# Altium schematic sheet STM3205P_Controller.SchDoc
size A3; Organization: Canis Tech; Address1: -; Address2: -; Address3: -; Address4: Indaiatuba/SP; DocumentNumber: 4; SheetNumber: 4; SheetTotal: 9; Address5: Brazil
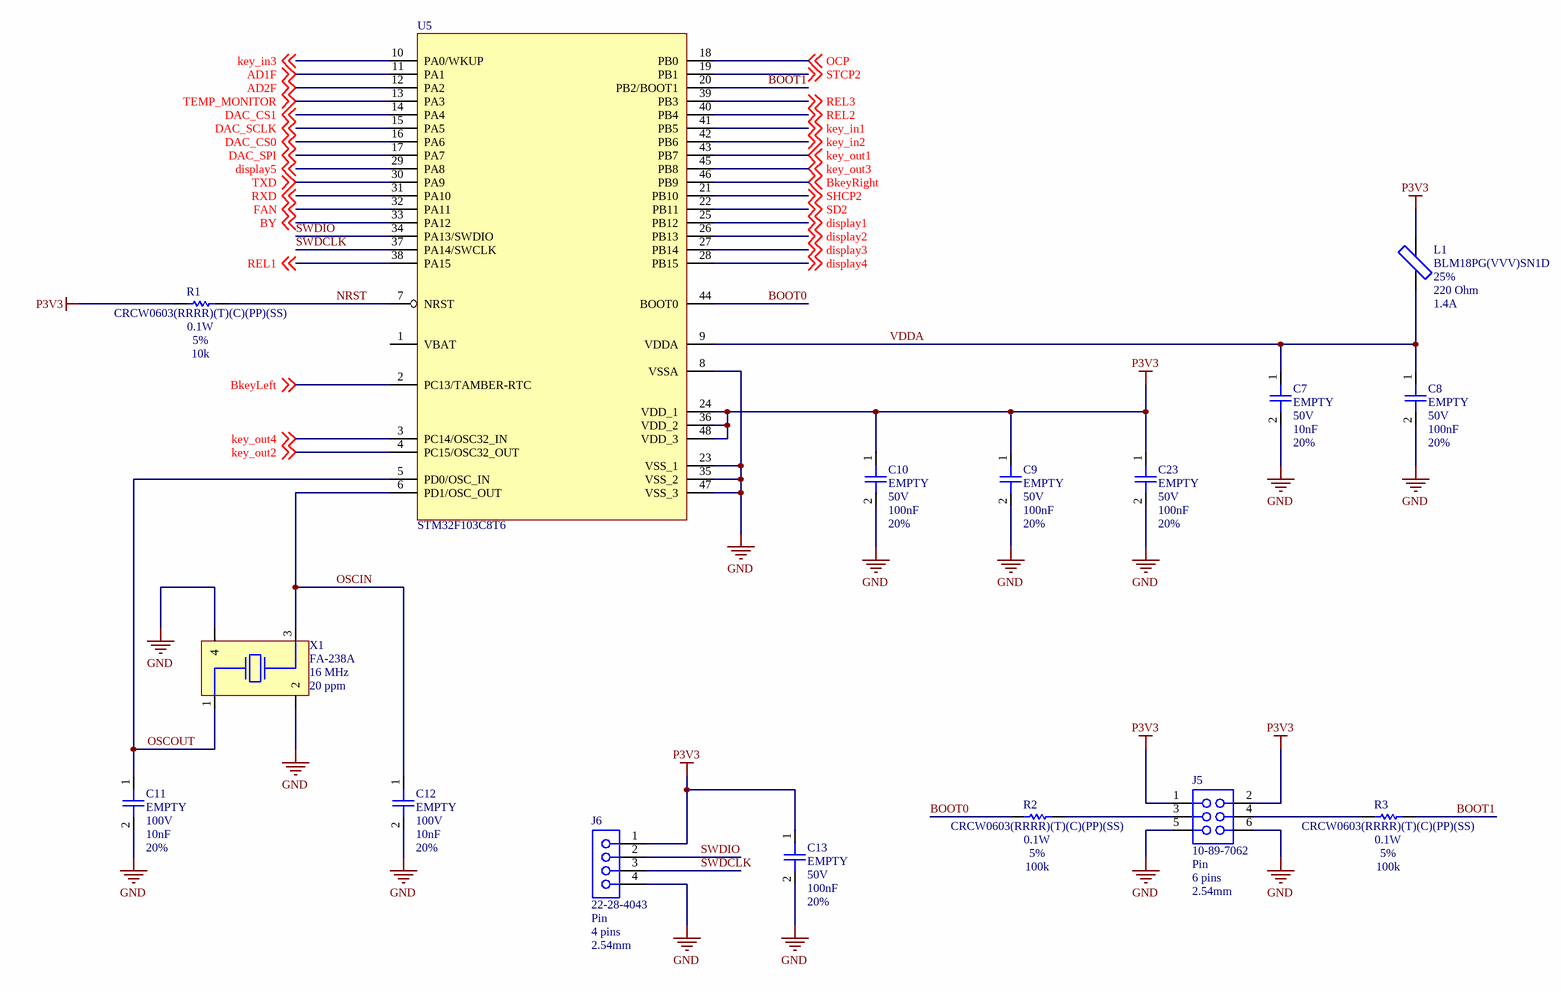
[diagram p0: STM3205P_Controller.SchDoc]

## Parts
C7  value 10nF  PartNumber1: EMPTY  Voltage: 50V  Tolerance: 20%  [CAP0603]  (hidden comment: CC0603)
C8  value 100nF  PartNumber1: EMPTY  Voltage: 50V  Tolerance: 20%  [CAP0603]  (hidden comment: CC0603)
C9  value 100nF  PartNumber1: EMPTY  Voltage: 50V  Tolerance: 20%  [CAP0603]  (hidden comment: CC0603)
C10  value 100nF  PartNumber1: EMPTY  Voltage: 50V  Tolerance: 20%  [CAP0603]  (hidden comment: CC0603)
C11  value 10nF  PartNumber1: EMPTY  Voltage: 100V  Tolerance: 20%  [CAP0603]  (hidden comment: CC0603)
C12  value 10nF  PartNumber1: EMPTY  Voltage: 100V  Tolerance: 20%  [CAP0603]  (hidden comment: CC0603)
C13  value 100nF  PartNumber1: EMPTY  Voltage: 50V  Tolerance: 20%  [CAP0603]  (hidden comment: CC0603)
C23  value 100nF  PartNumber1: EMPTY  Voltage: 50V  Tolerance: 20%  [CAP0603]  (hidden comment: CC0603)
J5  Type: Pin  Pins: 6 pins  Pitch: 2.54mm  [CONDIL06STRMALE_100_100]  (hidden comment: 10-89-7062)
J6  Type: Pin  Pins: 4 pins  Pitch: 2.54mm  [CONSIL04STRMALE_100_100]  (hidden comment: 22-28-4043)
L1  value 220 Ohm  PartNumber1: BLM18PG(VVV)SN1D  Tolerance: 25%  Current: 1.4A  [IND0603]  (hidden comment: BLM18)
R1  value 10k  PartNumber1: CRCW0603(RRRR)(T)(C)(PP)(SS)  Power: 0.1W  Tolerance: 5%  [RES0603]  (hidden comment: Chip Resistor)
R2  value 100k  PartNumber1: CRCW0603(RRRR)(T)(C)(PP)(SS)  Power: 0.1W  Tolerance: 5%  [RES0603]  (hidden comment: Chip Resistor)
R3  value 100k  PartNumber1: CRCW0603(RRRR)(T)(C)(PP)(SS)  Power: 0.1W  Tolerance: 5%  [RES0603]  (hidden comment: Chip Resistor)
U5  STM32F103C8T6  [LQFP-48]
X1  value 16 MHz  Tolerance: 20 ppm  [CR3225]  (hidden comment: FA-238A)

## Nets
GND: C7.2 C8.2 C9.2 C10.2 C11.2 C12.2 C13.2 C23.2 J5.5 J5.6 J6.4 U5.8(VSSA) U5.23(VSS_1) U5.35(VSS_2) U5.47(VSS_3) X1.2 X1.4
P3V3: C9.1 C10.1 C13.1 C23.1 J5.1 J5.2 J6.1 L1.2 R1.1 U5.24(VDD_1) U5.36(VDD_2) U5.48(VDD_3)
AD1F: U5.11(PA1) ; off-sheet AD1F
AD2F: U5.12(PA2) ; off-sheet AD2F
BkeyLeft: U5.2(PC13/TAMBER-RTC) ; off-sheet BkeyLeft
BkeyRight: U5.46(PB9) ; off-sheet BkeyRight
BOOT0: R2.1 U5.44(BOOT0)
BOOT1: R3.2 U5.20(PB2/BOOT1)
BY: U5.33(PA12) ; off-sheet BY
DAC_CS0: U5.16(PA6) ; off-sheet DAC_CS0
DAC_CS1: U5.14(PA4) ; off-sheet DAC_CS1
DAC_SCLK: U5.15(PA5) ; off-sheet DAC_SCLK
DAC_SPI: U5.17(PA7) ; off-sheet DAC_SPI
display1: U5.25(PB12) ; off-sheet display1
display2: U5.26(PB13) ; off-sheet display2
display3: U5.27(PB14) ; off-sheet display3
display4: U5.28(PB15) ; off-sheet display4
display5: U5.29(PA8) ; off-sheet display5
FAN: U5.32(PA11) ; off-sheet FAN
key_in1: U5.41(PB5) ; off-sheet key_in1
key_in2: U5.42(PB6) ; off-sheet key_in2
key_in3: U5.10(PA0/WKUP) ; off-sheet key_in3
key_out1: U5.43(PB7) ; off-sheet key_out1
key_out2: U5.4(PC15/OSC32_OUT) ; off-sheet key_out2
key_out3: U5.45(PB8) ; off-sheet key_out3
key_out4: U5.3(PC14/OSC32_IN) ; off-sheet key_out4
NRST: R1.2 U5.7(NRST)
OCP: U5.18(PB0) ; off-sheet OCP
OSCIN: C12.1 U5.6(PD1/OSC_OUT) X1.3
OSCOUT: C11.1 U5.5(PD0/OSC_IN) X1.1
REL1: U5.38(PA15) ; off-sheet REL1
REL2: U5.40(PB4) ; off-sheet REL2
REL3: U5.39(PB3) ; off-sheet REL3
RXD: U5.31(PA10) ; off-sheet RXD
SD2: U5.22(PB11) ; off-sheet SD2
SHCP2: U5.21(PB10) ; off-sheet SHCP2
STCP2: U5.19(PB1) ; off-sheet STCP2
SWDCLK: J6.3 U5.37(PA14/SWCLK)
SWDIO: J6.2 U5.34(PA13/SWDIO)
TEMP_MONITOR: U5.13(PA3) ; off-sheet TEMP_MONITOR
TXD: U5.30(PA9) ; off-sheet TXD
VDDA: C7.1 C8.1 L1.1 U5.9(VDDA)
NetJ5_3: J5.3 R2.2
NetJ5_4: J5.4 R3.1

Not connected (* = marked no-connect by the designer): U5 1(VBAT)

## Notes on the sheet
- Title
- Author
- Checked By
- Variant
- Size:
- Revision:
- A3
- Date:
- Project
- Time:
- Sheet
- of
- File:

## Library data of the parts
C7-C13 C23 = CC0603: Surface Mount Multilayer Ceramic Chip Capacitors  for Commercial Applications; Manufacturer1: Yageo; Published: 19-Jun-2016; LatestRevisionDate: 19-Jun-2016; Publisher: Lucas Moraes; PackageReference: CAP0603; PackageDescription: CAP0603;2 Leads
J5 = 10-89-7062: Headers & Wire Housings C-Grid PCB Conn SR V onn SR Vt Tn-A 8Ckt; Manufacturer1: Molex; LastRevisionNote: Created; Gender: Male; Direction: 180; Published: 12-Sep-2017; LatestRevisionDate: 12-Sep-2017; PackageReference: CONDIL6; Publisher: Lucas Moraes; PackageDescription: CONDIL6; 6 Leads; PartNumber1: 10-89-7062
J6 = 22-28-4043: Headers & Wire Housings 04 MODII HDR SRST B/A .100CL; Manufacturer1: Molex; LastRevisionNote: Created; Gender: Male; Published: 27-Mar-2023; LatestRevisionDate: 27-Mar-2023; PackageReference: CONSIL04STRMALE_100_100; Publisher: Lucas Moraes; PackageDescription: CONSIL04STRMALE_100_100; 4 Leads; PartNumber1: 22-28-4043
L1 = BLM18: Ferrite Beads 0603; Manufacturer1: Murata Electronics; Code: 221; LatestRevisionDate: 22-Dec-2016; PackageReference: IND0603; Publisher: Lucas Moraes; PackageDescription: IND0603; 2 Leads; Published: 22-Dec-2016
R1-R3 = CRCW0603: Thick Film Chip Resistors with CECC Approval,  available with Established Reliability; Manufacturer1: Vishay; LatestRevisionDate: 06-May-2016; PackageReference: 0603; Publisher: Lucas Moraes; PackageDescription: SMD 0603; 2 Leads; Published: 06-May-2016
U5 = STM32F103C8T6: 32-bit Microcontrollers - ARM Cortex-M0+ 32kB Flash, 6kB RAM; Manufacturer1: STMicroelectronics; Published: 01-May-2024; LatestRevisionDate: 01-May-2024; LatestRevisionNote: Created; PackageReference: LQFP-48; Publisher: Lucas Moraes; PackageDescription: LQFP-48; 48 leads; PartNumber1: STM32F103C8T6
X1 = FA-238A: Crystals FA-238A XTAL MHZ -40 125C 7.0PF 250TR; Manufacturer1: Epson Timing; Published: 03-Dec-2021; LatestRevisionDate: 03-Dec-2021; Publisher: Lucas Moraes; PackageReference: FA-238A; PackageDescription: FA-238A;2 Leads; Datasheet: https://br.mouser.com/datasheet/2/137/FA_238A_en-1649567.pdf; PartNumber1: FA-238A